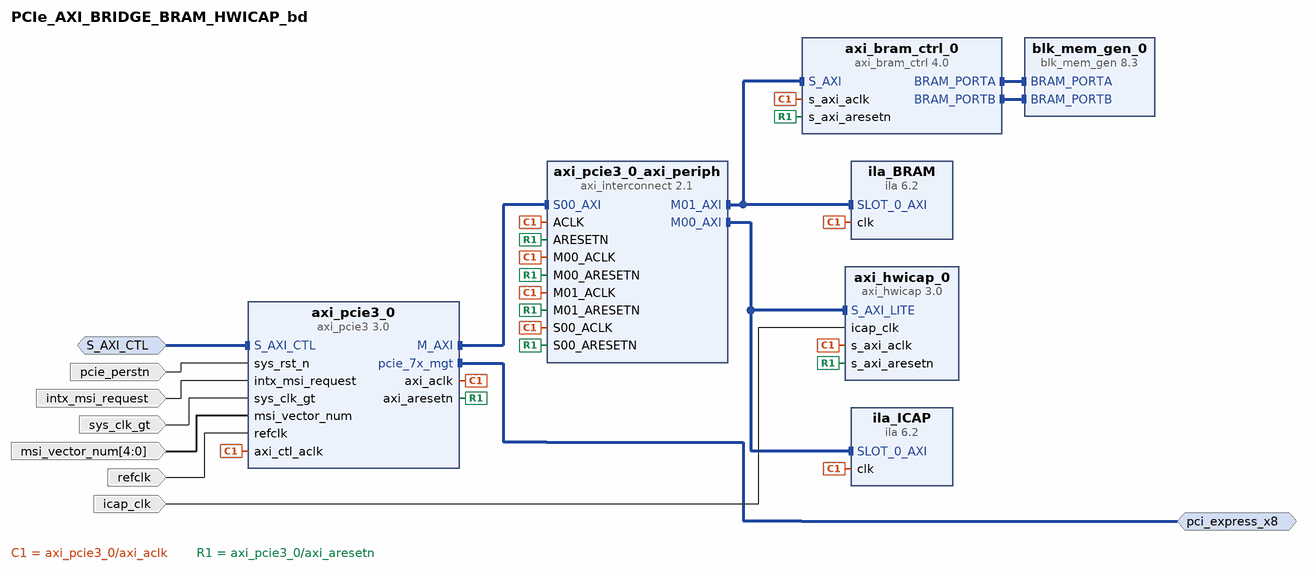
[diagram p0: block diagram of the top level]
# Vivado block design PCIe_AXI_BRIDGE_BRAM_HWICAP_bd, xcku040-ffva1156-2-e, Vivado 2017.1
create_bd_design PCIe_AXI_BRIDGE_BRAM_HWICAP_bd

create_bd_intf_port -mode Master -vlnv xilinx.com:interface:pcie_7x_mgt_rtl:1.0 pci_express_x8
create_bd_intf_port -mode Slave -vlnv xilinx.com:interface:aximm_rtl:1.0 S_AXI_CTL
set_property -dict [list \
  CONFIG.DATA_WIDTH 32 \
  CONFIG.PROTOCOL AXI4LITE \
  CONFIG.FREQ_HZ 250000000 \
  CONFIG.ID_WIDTH 0 \
  CONFIG.ADDR_WIDTH 12 \
  CONFIG.AWUSER_WIDTH 0 \
  CONFIG.ARUSER_WIDTH 0 \
  CONFIG.WUSER_WIDTH 0 \
  CONFIG.RUSER_WIDTH 0 \
  CONFIG.BUSER_WIDTH 0 \
  CONFIG.READ_WRITE_MODE READ_WRITE \
  CONFIG.HAS_BURST 0 \
  CONFIG.HAS_LOCK 0 \
  CONFIG.HAS_PROT 0 \
  CONFIG.HAS_CACHE 0 \
  CONFIG.HAS_QOS 0 \
  CONFIG.HAS_REGION 0 \
  CONFIG.HAS_WSTRB 1 \
  CONFIG.HAS_BRESP 1 \
  CONFIG.HAS_RRESP 1 \
  CONFIG.SUPPORTS_NARROW_BURST 0 \
  CONFIG.NUM_READ_OUTSTANDING 1 \
  CONFIG.NUM_WRITE_OUTSTANDING 1 \
  CONFIG.MAX_BURST_LENGTH 1 \
  CONFIG.NUM_READ_THREADS 1 \
  CONFIG.NUM_WRITE_THREADS 1 \
  CONFIG.RUSER_BITS_PER_BYTE 0 \
  CONFIG.WUSER_BITS_PER_BYTE 0 \
] [get_bd_intf_ports S_AXI_CTL]
create_bd_port -dir I -type rst pcie_perstn
set_property -dict {CONFIG.POLARITY ACTIVE_LOW} [get_bd_ports pcie_perstn]
create_bd_port -dir I intx_msi_request
create_bd_port -dir I -type clk sys_clk_gt
create_bd_port -dir I -from 4 -to 0 msi_vector_num
create_bd_port -dir I -type clk refclk
create_bd_port -dir I -type clk icap_clk
set_property -dict [list \
  CONFIG.FREQ_HZ 100000000 \
  CONFIG.CLK_DOMAIN PCIe_AXI_BRIDGE_BRAM_HWICAP_bd_axi_pcie3_0_0_axi_aclk \
] [get_bd_ports icap_clk]

create_bd_cell -type ip -vlnv xilinx.com:ip:axi_bram_ctrl:4.0 axi_bram_ctrl_0
create_bd_cell -type ip -vlnv xilinx.com:ip:axi_hwicap:3.0 axi_hwicap_0
create_bd_cell -type ip -vlnv xilinx.com:ip:axi_pcie3:3.0 axi_pcie3_0
set_property -dict [list \
  CONFIG.pl_link_cap_max_link_speed 8.0_GT/s \
  CONFIG.axi_data_width 256_bit \
  CONFIG.axisten_freq 250 \
  CONFIG.en_axi_slave_if false \
  CONFIG.sys_reset_polarity ACTIVE_LOW \
  CONFIG.pf0_device_id 8038 \
  CONFIG.pf0_bar0_size 64 \
  CONFIG.AXIBAR_NUM 1 \
  CONFIG.axibar_0 0x0000000000000000 \
  CONFIG.axibar_highaddr_0 0x000000000000FFFF \
  CONFIG.BASEADDR 00001000 \
  CONFIG.HIGHADDR 00001FFF \
  CONFIG.SYS_RST_N_BOARD_INTERFACE pcie_perstn \
  CONFIG.PCIE_BOARD_INTERFACE pci_express_x8 \
  CONFIG.axi_aclk_loopback true \
] [get_bd_cells axi_pcie3_0]
create_bd_cell -type ip -vlnv xilinx.com:ip:axi_interconnect:2.1 axi_pcie3_0_axi_periph
set_property -dict [list \
  CONFIG.NUM_MI 2 \
  CONFIG.M00_HAS_REGSLICE 3 \
  CONFIG.M01_HAS_REGSLICE 3 \
  CONFIG.S00_HAS_REGSLICE 3 \
] [get_bd_cells axi_pcie3_0_axi_periph]
create_bd_cell -type ip -vlnv xilinx.com:ip:blk_mem_gen:8.3 blk_mem_gen_0
set_property -dict [list \
  CONFIG.Memory_Type True_Dual_Port_RAM \
  CONFIG.Enable_B Use_ENB_Pin \
  CONFIG.Use_RSTB_Pin true \
  CONFIG.Port_B_Clock 100 \
  CONFIG.Port_B_Write_Rate 50 \
  CONFIG.Port_B_Enable_Rate 100 \
] [get_bd_cells blk_mem_gen_0]
create_bd_cell -type ip -vlnv xilinx.com:ip:ila:6.2 ila_BRAM
set_property -dict {CONFIG.C_NUM_OF_PROBES 44 CONFIG.C_ENABLE_ILA_AXI_MON true CONFIG.C_MONITOR_TYPE AXI} [get_bd_cells ila_BRAM]
create_bd_cell -type ip -vlnv xilinx.com:ip:ila:6.2 ila_ICAP
set_property -dict {CONFIG.C_NUM_OF_PROBES 19 CONFIG.C_ENABLE_ILA_AXI_MON true CONFIG.C_MONITOR_TYPE AXI} [get_bd_cells ila_ICAP]

# ---- connections ----

connect_bd_intf_net [get_bd_intf_pins blk_mem_gen_0/BRAM_PORTA] [get_bd_intf_pins axi_bram_ctrl_0/BRAM_PORTA]
connect_bd_intf_net [get_bd_intf_pins blk_mem_gen_0/BRAM_PORTB] [get_bd_intf_pins axi_bram_ctrl_0/BRAM_PORTB]
connect_bd_intf_net [get_bd_intf_pins axi_pcie3_0/M_AXI] [get_bd_intf_pins axi_pcie3_0_axi_periph/S00_AXI]
connect_bd_intf_net [get_bd_intf_pins axi_pcie3_0_axi_periph/M00_AXI] [get_bd_intf_pins axi_hwicap_0/S_AXI_LITE]
connect_bd_intf_net [get_bd_intf_pins axi_pcie3_0_axi_periph/M00_AXI] [get_bd_intf_pins ila_ICAP/SLOT_0_AXI]
connect_bd_intf_net [get_bd_intf_pins axi_pcie3_0_axi_periph/M01_AXI] [get_bd_intf_pins axi_bram_ctrl_0/S_AXI]
connect_bd_intf_net [get_bd_intf_pins axi_pcie3_0_axi_periph/M01_AXI] [get_bd_intf_pins ila_BRAM/SLOT_0_AXI]
connect_bd_intf_net [get_bd_intf_ports pci_express_x8] [get_bd_intf_pins axi_pcie3_0/pcie_7x_mgt]
connect_bd_intf_net [get_bd_intf_ports S_AXI_CTL] [get_bd_intf_pins axi_pcie3_0/S_AXI_CTL]
connect_bd_net [get_bd_ports pcie_perstn] [get_bd_pins axi_pcie3_0/sys_rst_n]
connect_bd_net [get_bd_pins axi_pcie3_0/axi_aclk] \
  [get_bd_pins axi_bram_ctrl_0/s_axi_aclk] [get_bd_pins axi_hwicap_0/s_axi_aclk] [get_bd_pins axi_pcie3_0/axi_ctl_aclk] \
  [get_bd_pins ila_BRAM/clk] [get_bd_pins axi_pcie3_0_axi_periph/ACLK] [get_bd_pins axi_pcie3_0_axi_periph/S00_ACLK] \
  [get_bd_pins axi_pcie3_0_axi_periph/M00_ACLK] [get_bd_pins axi_pcie3_0_axi_periph/M01_ACLK] [get_bd_pins ila_ICAP/clk]
connect_bd_net [get_bd_pins axi_pcie3_0/axi_aresetn] \
  [get_bd_pins axi_bram_ctrl_0/s_axi_aresetn] [get_bd_pins axi_hwicap_0/s_axi_aresetn] \
  [get_bd_pins axi_pcie3_0_axi_periph/ARESETN] [get_bd_pins axi_pcie3_0_axi_periph/S00_ARESETN] \
  [get_bd_pins axi_pcie3_0_axi_periph/M00_ARESETN] [get_bd_pins axi_pcie3_0_axi_periph/M01_ARESETN]
connect_bd_net [get_bd_ports intx_msi_request] [get_bd_pins axi_pcie3_0/intx_msi_request]
connect_bd_net [get_bd_ports sys_clk_gt] [get_bd_pins axi_pcie3_0/sys_clk_gt]
connect_bd_net [get_bd_ports msi_vector_num] [get_bd_pins axi_pcie3_0/msi_vector_num]
connect_bd_net [get_bd_ports refclk] [get_bd_pins axi_pcie3_0/refclk]
connect_bd_net [get_bd_ports icap_clk] [get_bd_pins axi_hwicap_0/icap_clk]

# ---- address map ----
assign_bd_address -offset 0x00000000 -range 32K -target_address_space [get_bd_addr_spaces axi_pcie3_0/M_AXI] [get_bd_addr_segs axi_hwicap_0/S_AXI_LITE/Reg]
assign_bd_address -offset 0x00008000 -range 32K -target_address_space [get_bd_addr_spaces axi_pcie3_0/M_AXI] [get_bd_addr_segs axi_bram_ctrl_0/S_AXI/Mem0]
assign_bd_address -offset 0x000 -range 4K -target_address_space [get_bd_addr_spaces S_AXI_CTL] [get_bd_addr_segs axi_pcie3_0/S_AXI_CTL/CTL0]

validate_bd_design
save_bd_design
